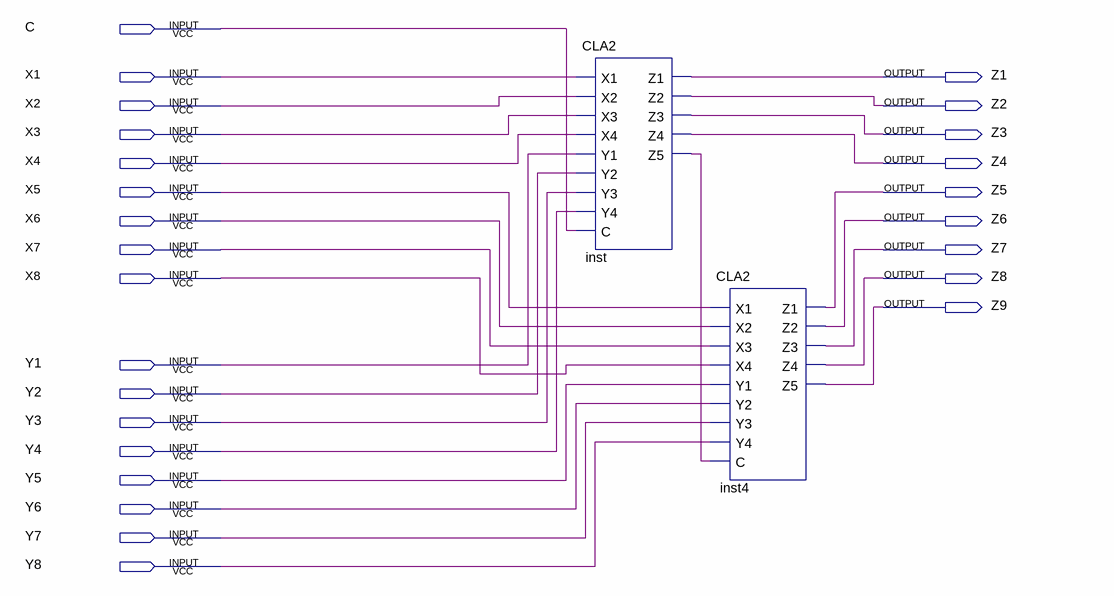
[diagram p0: schematic sheet]
// Quartus schematic CLA8.bdf as structural Verilog: 2 symbols, 26 pins
module CLA8 (
  input  C,
  input  X1,
  input  X2,
  input  X3,
  input  X4,
  input  X5,
  input  X6,
  input  X7,
  input  X8,
  input  Y1,
  input  Y2,
  input  Y3,
  input  Y4,
  input  Y5,
  input  Y6,
  input  Y7,
  input  Y8,
  output Z1,
  output Z2,
  output Z3,
  output Z4,
  output Z5,
  output Z6,
  output Z7,
  output Z8,
  output Z9
);

  wire inst_z5;

  CLA2 inst (
    .X1(X1), .X2(X2), .X3(X3), .X4(X4), .Y1(Y1), .Y2(Y2), .Y3(Y3), .Y4(Y4), .C(C), .Z1(Z1), .Z2(Z2), .Z3(Z3),
    .Z4(Z4), .Z5(inst_z5));
  CLA2 inst4 (
    .X1(X5), .X2(X6), .X3(X7), .X4(X8), .Y1(Y5), .Y2(Y6), .Y3(Y7), .Y4(Y8), .C(inst_z5), .Z1(Z5), .Z2(Z6),
    .Z3(Z7), .Z4(Z8), .Z5(Z9));
endmodule
